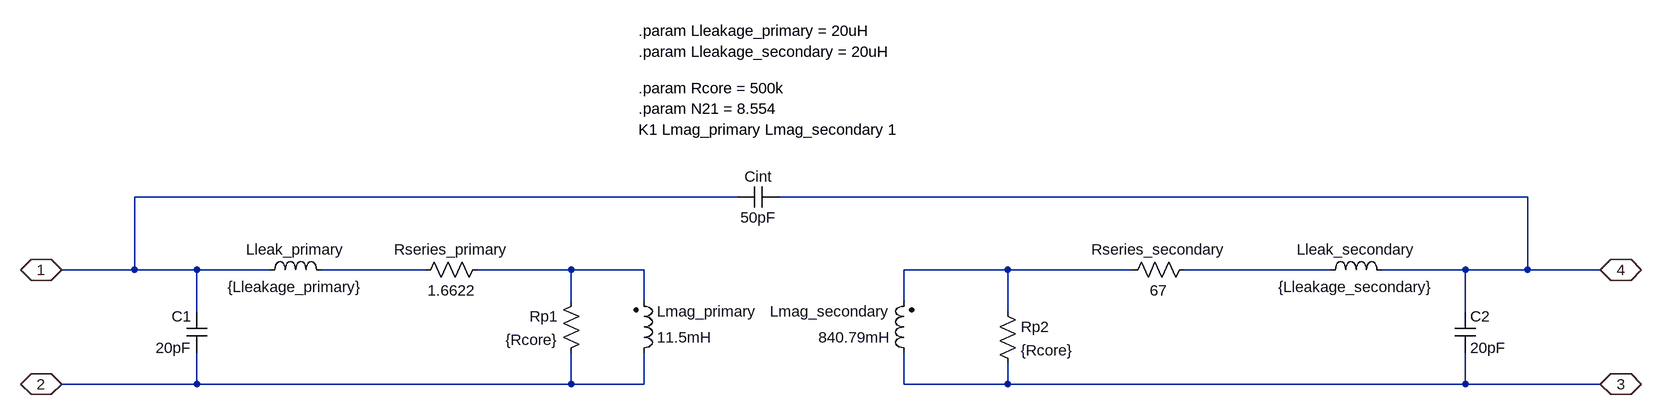
[diagram p0: schematic MET_35.asc]
MET_35.asc, the LTspice schematic file:
Version 4
SHEET 1 2208 680
WIRE 688 32 -240 32
WIRE 1904 32 752 32
WIRE -240 144 -240 32
WIRE -240 144 -352 144
WIRE -144 144 -240 144
WIRE -32 144 -144 144
WIRE 208 144 48 144
WIRE 432 144 288 144
WIRE 544 144 432 144
WIRE 1104 144 944 144
WIRE 1296 144 1104 144
WIRE 1600 144 1376 144
WIRE 1808 144 1680 144
WIRE 1904 144 1904 32
WIRE 1904 144 1808 144
WIRE 2016 144 1904 144
WIRE 432 192 432 144
WIRE 544 192 544 144
WIRE 944 192 944 144
WIRE -144 208 -144 144
WIRE 1104 208 1104 144
WIRE 1808 208 1808 144
WIRE -144 320 -144 272
WIRE -144 320 -352 320
WIRE 432 320 432 272
WIRE 432 320 -144 320
WIRE 544 320 544 272
WIRE 544 320 432 320
WIRE 944 320 944 272
WIRE 1104 320 1104 288
WIRE 1104 320 944 320
WIRE 1808 320 1808 272
WIRE 1808 320 1104 320
WIRE 2016 320 1808 320
FLAG -352 144 1
IOPIN -352 144 BiDir
FLAG -352 320 2
IOPIN -352 320 BiDir
FLAG 2016 320 3
IOPIN 2016 320 BiDir
FLAG 2016 144 4
IOPIN 2016 144 BiDir
SYMBOL res 192 160 R270
WINDOW 0 32 56 VTop 2
WINDOW 3 0 56 VBottom 2
SYMATTR InstName Rseries_primary
SYMATTR Value 1.6622
SYMBOL ind2 528 288 M180
WINDOW 0 36 80 Left 2
WINDOW 3 36 40 Left 2
SYMATTR InstName Lmag_primary
SYMATTR Value 11.5mH
SYMATTR Type ind
SYMBOL ind2 960 288 R180
WINDOW 0 36 80 Left 2
WINDOW 3 36 40 Left 2
SYMATTR InstName Lmag_secondary
SYMATTR Value 840.79mH
SYMATTR Type ind
SYMBOL res 1280 160 R270
WINDOW 0 32 56 VTop 2
WINDOW 3 0 56 VBottom 2
SYMATTR InstName Rseries_secondary
SYMATTR Value 67
SYMBOL cap -128 208 M0
SYMATTR InstName C1
SYMATTR Value 20pF
SYMBOL cap 1792 208 R0
SYMATTR InstName C2
SYMATTR Value 20pF
SYMBOL cap 688 48 R270
WINDOW 0 32 32 VTop 2
WINDOW 3 0 32 VBottom 2
SYMATTR InstName Cint
SYMATTR Value 50pF
SYMBOL ind -48 160 R270
WINDOW 0 32 56 VTop 2
WINDOW 3 5 56 VBottom 2
SYMATTR InstName Lleak_primary
SYMATTR Value {Lleakage_primary}
SYMBOL ind 1584 160 R270
WINDOW 0 32 56 VTop 2
WINDOW 3 5 56 VBottom 2
SYMATTR InstName Lleak_secondary
SYMATTR Value {Lleakage_secondary}
SYMBOL res 448 176 M0
SYMATTR InstName Rp1
SYMATTR Value {Rcore}
SYMBOL res 1088 192 R0
SYMATTR InstName Rp2
SYMATTR Value {Rcore}
TEXT 536 -104 Left 2 !.param N21 = 8.554
TEXT 536 -72 Left 2 !K1 Lmag_primary Lmag_secondary 1
TEXT 536 -136 Left 2 !.param Rcore = 500k
TEXT 536 -224 Left 2 !.param Lleakage_primary = 20uH
TEXT 536 -192 Left 2 !.param Lleakage_secondary = 20uH

The netlist it stands for:
* MET_35.asc
Rseries_primary N001 N002 1.6622
Lmag_primary 2 N002 11.5mH
Lmag_secondary 3 N003 840.79mH
Rseries_secondary N003 N004 67
C1 1 2 20pF
C2 4 3 20pF
Cint 1 4 50pF
Lleak_primary 1 N001 {Lleakage_primary}
Lleak_secondary N004 4 {Lleakage_secondary}
Rp1 N002 2 {Rcore}
Rp2 N003 3 {Rcore}
.param N21 = 8.554
K1 Lmag_primary Lmag_secondary 1
.param Rcore = 500k
.param Lleakage_primary = 20uH
.param Lleakage_secondary = 20uH
.backanno
.end